# Altium project Athena.PrjPcb
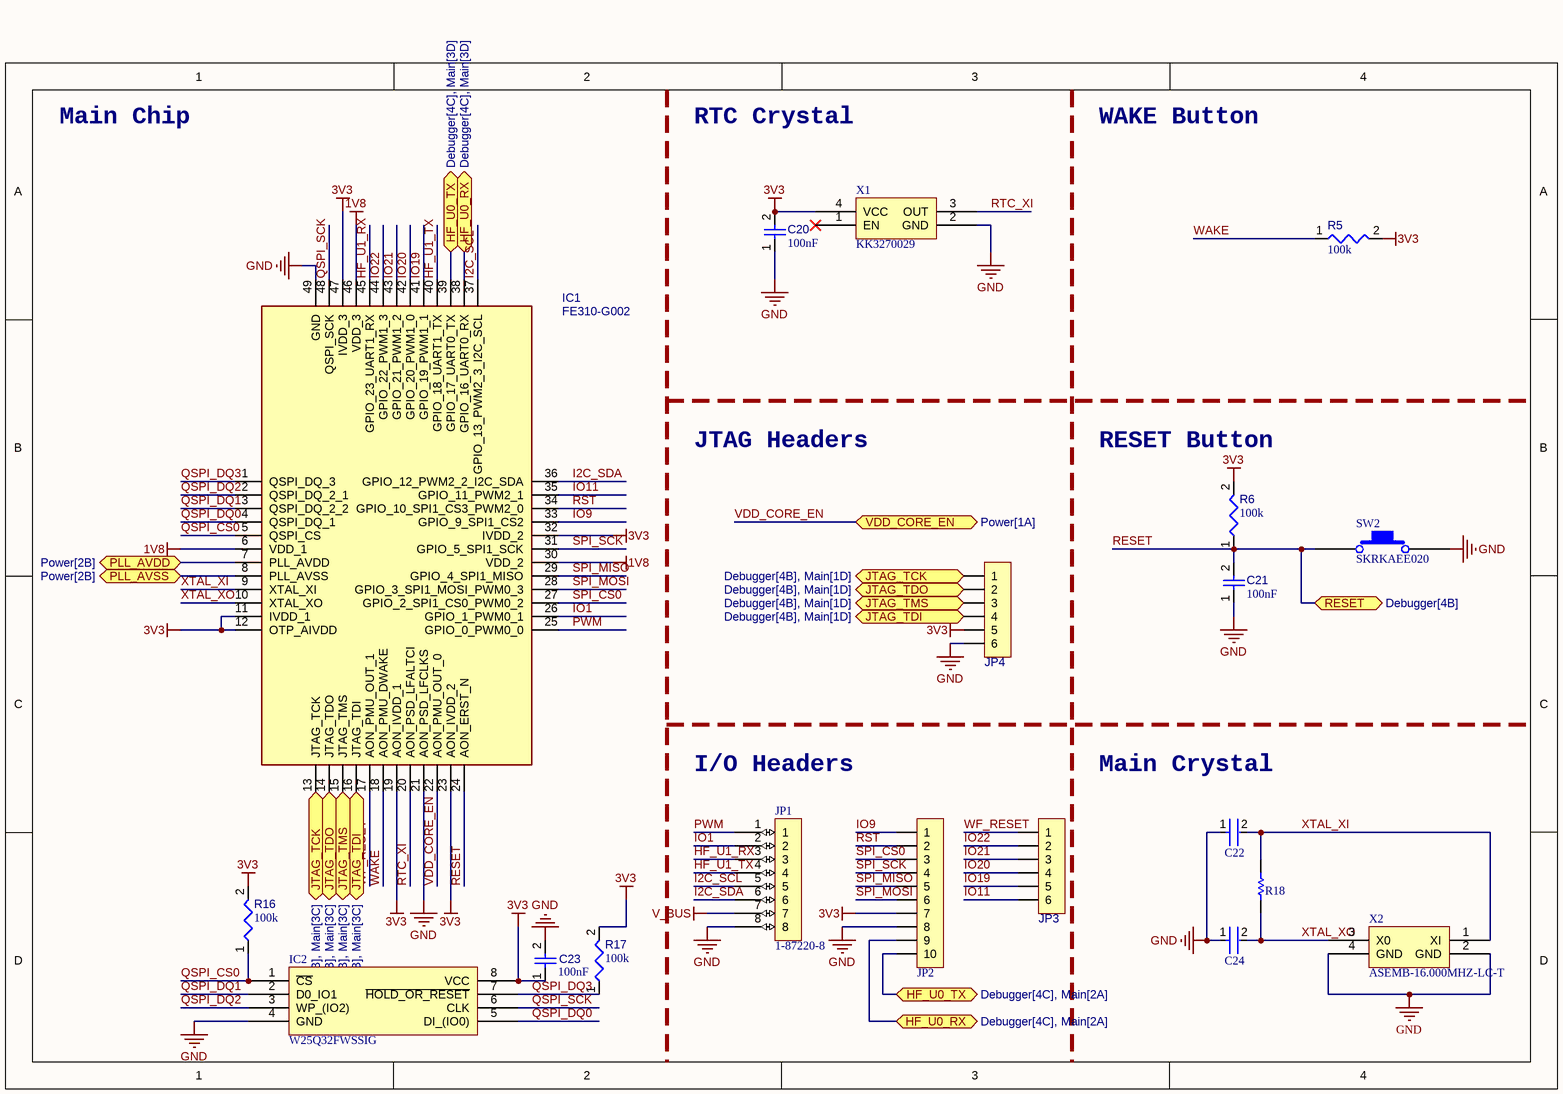
[diagram p0: Main.SchDoc]
3 sheets, 82 parts. Net scope: flat (ports and power ports of the same name join across sheets).
Board file: Board.PcbDoc
Sheets:
  Main.SchDoc
  Power.SchDoc
  Debugger.SchDoc

## Sheet Main.SchDoc
size A4; SheetNumber: 1; SheetTotal: 3

### Parts
C20  value 100nF  [CAPC1608X90X40NL10T20]  (hidden comment: Capacitor 100 nF +/-10% 50 V 0603)
C21  value 100nF  [CAPC1608X90X40NL10T20]  (hidden comment: Capacitor 100 nF +/-10% 50 V 0603)
C22  06035A220JAT2A  [FP-0603-L_1_6_0_15-W_0_81-IPC_C]  (value not drawn)
C23  value 100nF  [CAPC1608X90X40NL10T20]  (hidden comment: Capacitor 100 nF +/-10% 50 V 0603)
C24  06035A220JAT2A  [FP-0603-L_1_6_0_15-W_0_81-IPC_C]  (value not drawn)
IC1  FE310-G002  [QFN40P600X600X93-49N]
IC2  W25Q32FWSSIG  [W25Q32FWSSIG-Footprint-1]
JP1  1-87220-8  [1-87220-8-Footprint-1]
JP2  HDR-1X10  [HDR2.54-LI-10P]  (value not drawn)
JP3  HDR-1X6  [HDR2.54-M-LI-6P]  (value not drawn)
JP4  HDR-1X6  [HDR2.54-M-LI-6P]  (value not drawn)
R5  value 100k  [RESC1608X55X25ML10T15]  (hidden comment: Resistor 100k +/-1% 0603 100 mW)
R6  value 100k  [RESC1608X55X25ML10T15]  (hidden comment: Resistor 100k +/-1% 0603 100 mW)
R16  value 100k  [RESC1608X55X25ML10T15]  (hidden comment: Resistor 100k +/-1% 0603 100 mW)
R17  value 100k  [RESC1608X55X25ML10T15]  (hidden comment: Resistor 100k +/-1% 0603 100 mW)
R18  RC0603FR-071ML  [RESC1608X55X25LL10T15]  (value not drawn)
SW2  SKRKAEE020  [RESC5020X04N]
X1  KK3270029  [KK3270029-Footprint-1]
X2  ASEMB-16.000MHZ-LC-T  [ASEMB-16.000MHZ-LC-T-Footprint-1]

### Ports
HF_U0_RX (bidir, see Debugger[4C], Main[2A]), HF_U0_RX (bidir, see Debugger[4C], Main[3D]), HF_U0_TX (bidir, see Debugger[4C], Main[2A]), HF_U0_TX (bidir, see Debugger[4C], Main[3D]), JTAG_TCK (bidir, see Debugger[4B], Main[1D]), JTAG_TCK (bidir, see Debugger[4B], Main[3C]), JTAG_TDI (bidir, see Debugger[4B], Main[1D]), JTAG_TDI (bidir, see Debugger[4B], Main[3C]), JTAG_TDO (bidir, see Debugger[4B], Main[1D]), JTAG_TDO (bidir, see Debugger[4B], Main[3C]), JTAG_TMS (bidir, see Debugger[4B], Main[1D]), JTAG_TMS (bidir, see Debugger[4B], Main[3C]), PLL_AVDD (bidir, see Power[2B]), PLL_AVSS (bidir, see Power[2B]), RESET (bidir, see Debugger[4B]), VDD_CORE_EN (bidir, see Power[1A])

### Nets
1V8: IC1.6(VDD_1) IC1.30(VDD_2) IC1.46(VDD_3)
3V3: C20.2 C23.1 IC1.11(IVDD_1) IC1.12(OTP_AIVDD) IC1.19(AON_IVDD_1) IC1.23(AON_IVDD_2) IC1.32(IVDD_2) IC1.47(IVDD_3) IC2.8(VCC) JP2.7 JP4.5 R5.2 R6.2 R16.2 R17.2 X1.4(VCC)
GND: C20.1 C21.1 C22.1 C23.2 C24.1 IC1.21(AON_PSD_LFCLKS) IC1.49(GND) IC2.4(GND) JP1.8 JP2.8 JP4.6 SW2.2 X1.2(GND) X2.2(GND) X2.4(GND)
V_BUS: JP1.7
HF_U1_RX: IC1.45(GPIO_23_UART1_RX) JP1.3
HF_U1_TX: IC1.40(GPIO_18_UART1_TX) JP1.4
I2C_SCL: IC1.37(GPIO_13_PWM2_3_I2C_SCL) JP1.5
I2C_SDA: IC1.36(GPIO_12_PWM2_2_I2C_SDA) JP1.6
IO1: IC1.26(GPIO_1_PWM0_1) JP1.2
IO9: IC1.33(GPIO_9_SPI1_CS2) JP2.1
IO11: IC1.35(GPIO_11_PWM2_1) JP3.6
IO19: IC1.41(GPIO_19_PWM1_1) JP3.5
IO20: IC1.42(GPIO_20_PWM1_0) JP3.4
IO21: IC1.43(GPIO_21_PWM1_2) JP3.3
IO22: IC1.44(GPIO_22_PWM1_3) JP3.2
JTAG_TCK: IC1.13(JTAG_TCK) JP4.1 ; port JTAG_TCK
JTAG_TDI: IC1.16(JTAG_TDI) JP4.4 ; port JTAG_TDI
JTAG_TDO: IC1.14(JTAG_TDO) JP4.2 ; port JTAG_TDO
JTAG_TMS: IC1.15(JTAG_TMS) JP4.3 ; port JTAG_TMS
PLL_AVDD: IC1.7(PLL_AVDD) ; port PLL_AVDD
PLL_AVSS: IC1.8(PLL_AVSS) ; port PLL_AVSS
PWM: IC1.25(GPIO_0_PWM0_0) JP1.1
QSPI_CS0: IC1.5(QSPI_CS) IC2.1(~{CS}) R16.1
QSPI_DQ0: IC1.4(QSPI_DQ_1) IC2.5(DI_(IO0))
QSPI_DQ1: IC1.3(QSPI_DQ_2_2) IC2.2(D0_IO1)
QSPI_DQ2: IC1.2(QSPI_DQ_2_1) IC2.3(WP_(IO2))
QSPI_DQ3: IC1.1(QSPI_DQ_3) IC2.7(~{HOLD_OR_RESET}) R17.1
QSPI_SCK: IC1.48(QSPI_SCK) IC2.6(CLK)
RESET: C21.2 IC1.24(AON_ERST_N) R6.1 SW2.1 ; port RESET
RST: IC1.34(GPIO_10_SPI1_CS3_PWM2_0) JP2.2
RTC_XI: IC1.20(AON_PSD_LFALTCI) X1.3(OUT)
SPI_CS0: IC1.27(GPIO_2_SPI1_CS0_PWM0_2) JP2.3
SPI_MISO: IC1.29(GPIO_4_SPI1_MISO) JP2.5
SPI_MOSI: IC1.28(GPIO_3_SPI1_MOSI_PWM0_3) JP2.6
SPI_SCK: IC1.31(GPIO_5_SPI1_SCK) JP2.4
UART0_RX: IC1.38(GPIO_16_UART0_RX) JP2.9 ; port HF_U0_RX
UART0_TX: IC1.39(GPIO_17_UART0_TX) JP2.10 ; port HF_U0_TX
VDD_CORE_EN: IC1.22(AON_PMU_OUT_0) ; port VDD_CORE_EN
WAKE: IC1.18(AON_PMU_DWAKE) R5.1
WF_RESET: IC1.17(AON_PMU_OUT_1) JP3.1
XTAL_XI: C22.2 IC1.9(XTAL_XI) R18.2 X2.1(XI)
XTAL_XO: C24.2 IC1.10(XTAL_XO) R18.1 X2.3(X0)

Not connected (* = marked no-connect by the designer): X1 1(EN)*

### Notes on the sheet
- Main Chip
- RTC Crystal
- WAKE Button
- JTAG Headers
- (near R6) RESET Button
- I/O Headers
- Main Crystal

### Library data of the parts
C20 C21 C23 = CMP-001-00017-6: Chip Capacitor, 100 nF, +/- 10%, 50 V, 0603 (1608 Metric); Voltage Rating: 50V; Capacitor Type: Ceramic; Tolerance: 10%; Mounting Technology: SM; Max Operating Temperature: 125°C; RoHS Compliant: True; Pins: 2; Case/Package: 0603; Min Operating Temperature: -55°C
C22 C24 = CMP-001-00085-1: 0603 22 pF 50V ±5% Tolerance C0G/NP0 Surface Mount Multilayer Ceramic Capacitor
IC1 = FE310-G002: Integrated Circuit; Manufacturer_Name: SiFive; Datasheet Link: https://sifive.cdn.prismic.io/sifive%2F3d777659-a0dd-49ed-a011-5bebba17aecf_fe310-g002-ds.pdf; Height: 0.93mm; Manufacturer_Part_Number: FE310-G002
IC2 = CMP-001-0001-2: IC Flash 32M Spi 104MHZ 8SOIC / 1.8V 32M-BIT Serial Flash Memory With Dual/quad Spi & Qpi
JP1 = CMP-002-00072-1: Conn Unshrouded Header HDR 1x8 POS 2.54mm Solder ST Thru-Hole Carton
JP2 = Header 10: 10P接插件; 版权归属: 淘宝ID:黄晶宝石; BOM名称: 10P接插件; 学习资源: https://shop463601444.taobao.com
JP3 JP4 = Header 6: 6P接插件; 联系卖家，免费查找封装: 唯一出售店铺网址https://shop463601444.taobao.com; 封装库来自淘宝卖家ID:黄晶宝石: 其他店铺购入均为盗版假冒封装库，请立即申请退款，本店现金奖励20~200元; BOM名称: 6P接插件
R5 R6 R16 R17 = CMP-009-00023-5: Chip Resistor, 100 KOhm, +/- 1%, 0.1 W, -55 to 155 degC, 0603 (1608 Metric); Voltage Rating: 50V; Power: 100mW; Max Operating Temperature: 155°C; RoHS Compliant: True; Tolerance: 1%; Pins: 2; Case/Package: 0603; Mounting Technology: SM; Min Operating Temperature: -55°C
R18 = CMP-009-00177-1: Res Thick Film 0603 1M Ohm 1% 1/10W ±100ppm/°C Molded SMD Paper T/R
SW2 = CMP-011-00014-1: Switch Tactile N.O. SPST Round Button Gull Wing 0.05A 12VDC 1.57N SMD T/R
X1 = CMP-023-00000-1: Xtal Osc Xo 32.7680KHZ Cmos SMD
X2 = CMP-023-00001-1: Oscillator MEMS 16MHz ±50ppm (Stability) 15pF LVCMOS 55% 1.8V/2.5V/3.3V Automotive 4-Pin QFN SMD T/R

## Sheet Power.SchDoc
size A4; SheetNumber: 2; SheetTotal: 3
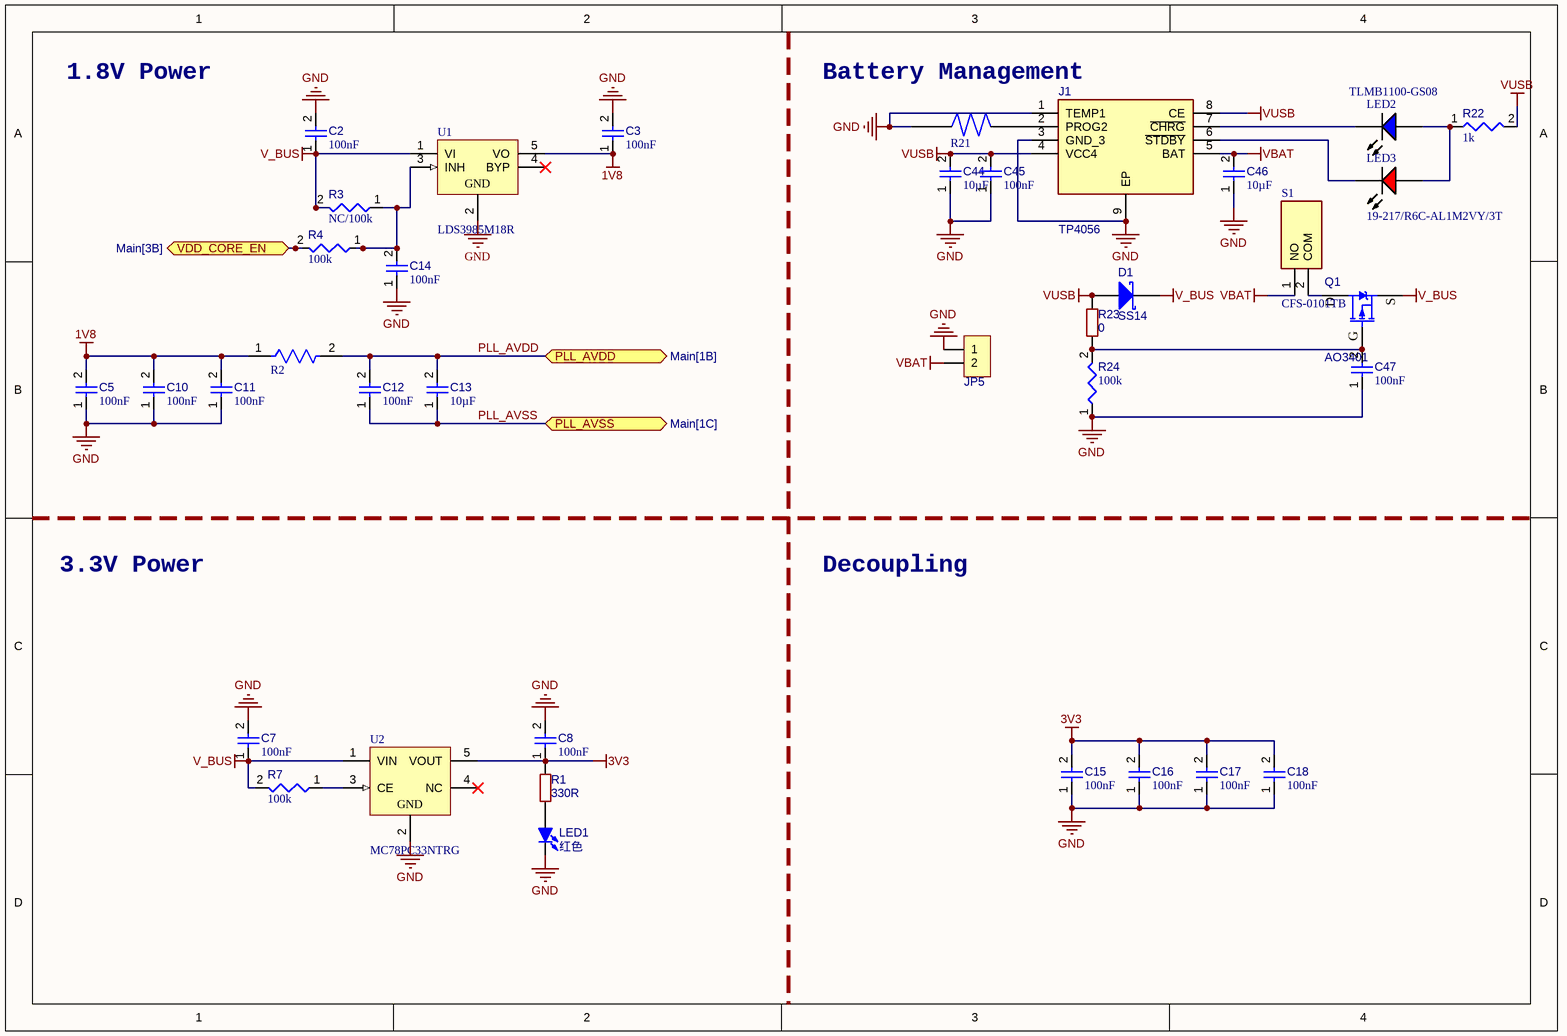
[diagram p1: Power.SchDoc]

### Parts
C2  value 100nF  [CAPC1608X90X40NL10T20]  (hidden comment: Capacitor 100 nF +/-10% 50 V 0603)
C3  value 100nF  [CAPC1608X90X40NL10T20]  (hidden comment: Capacitor 100 nF +/-10% 50 V 0603)
C5  value 100nF  [CAPC1608X90X40NL10T20]  (hidden comment: Capacitor 100 nF +/-10% 50 V 0603)
C7  value 100nF  [CAPC1608X90X40NL10T20]  (hidden comment: Capacitor 100 nF +/-10% 50 V 0603)
C8  value 100nF  [CAPC1608X90X40NL10T20]  (hidden comment: Capacitor 100 nF +/-10% 50 V 0603)
C10  value 100nF  [CAPC1608X90X40NL10T20]  (hidden comment: Capacitor 100 nF +/-10% 50 V 0603)
C11  value 100nF  [CAPC1608X90X40NL10T20]  (hidden comment: Capacitor 100 nF +/-10% 50 V 0603)
C12  value 100nF  [CAPC1608X90X40NL10T20]  (hidden comment: Capacitor 100 nF +/-10% 50 V 0603)
C13  value 10µF  [CAPC0603(1608)100_L]  (hidden comment: Capacitor 10µF +/-20% 10V 0603)
C14  value 100nF  [CAPC1608X90X40NL10T20]  (hidden comment: Capacitor 100 nF +/-10% 50 V 0603)
C15  value 100nF  [CAPC1608X90X40NL10T20]  (hidden comment: Capacitor 100 nF +/-10% 50 V 0603)
C16  value 100nF  [CAPC1608X90X40NL10T20]  (hidden comment: Capacitor 100 nF +/-10% 50 V 0603)
C17  value 100nF  [CAPC1608X90X40NL10T20]  (hidden comment: Capacitor 100 nF +/-10% 50 V 0603)
C18  value 100nF  [CAPC1608X90X40NL10T20]  (hidden comment: Capacitor 100 nF +/-10% 50 V 0603)
C44  value 10µF  [CAPC0603(1608)100_L]  (hidden comment: Capacitor 10µF +/-20% 10V 0603)
C45  value 100nF  [CAPC1608X90X40NL10T20]  (hidden comment: Capacitor 100 nF +/-10% 50 V 0603)
C46  value 10µF  [CAPC0603(1608)100_L]  (hidden comment: Capacitor 10µF +/-20% 10V 0603)
C47  value 100nF  [CAPC1608X90X40NL10T20]  (hidden comment: Capacitor 100 nF +/-10% 50 V 0603)
D1  SS14  [SMA]
J1  TP4056  [SOIC127P600X175-9N]
JP5  HDR-1X2  [XH2.54-LS-2P]  (value not drawn)
LED1  红色  [LED0603_R]
LED2  TLMB1100-GS08  [VISH-TLMX1100-2_V]
LED3  19-217/R6C-AL1M2VY/3T  [EVRL-0603-2_V]
Q1  AO3401  [SOT23-3N]
R1  330R  [R0603_NS]
R2  CRGP0603F100R  [FP-CRGP0603-IPC_B]  (value not drawn)
R3  value NC/100k  [RESC1608X55X25ML10T15]  (hidden comment: Resistor 100k +/-1% 0603 100 mW)
R4  value 100k  [RESC1608X55X25ML10T15]  (hidden comment: Resistor 100k +/-1% 0603 100 mW)
R7  value 100k  [RESC1608X55X25ML10T15]  (hidden comment: Resistor 100k +/-1% 0603 100 mW)
R21  CRCW06031K20FKTA  [CRCW06031K20FKTA-Footprint-1]  (value not drawn)
R22  value 1k  [RESC1608X55X25ML10T15]  (hidden comment: Resistor 1k +/-1% 0603 100 mW)
R23  0  [R0603_NS]
R24  value 100k  [RESC1608X55X25ML10T15]  (hidden comment: Resistor 100k +/-1% 0603 100 mW)
S1  CFS-0101TB  [CFS0101TB]
U1  LDS3985M18R  [SOT23-5L_N]
U2  MC78PC33NTRG  [ONSC-SOT-23-5-1212-01_O_V]

### Ports
PLL_AVDD (bidir, see Main[1B]), PLL_AVSS (bidir, see Main[1C]), VDD_CORE_EN (bidir, see Main[3B])

### Nets
1V8: C3.1 C5.2 C10.2 C11.2 R2.1 U1.5(VO)
3V3: C8.1 C15.2 C16.2 C17.2 C18.2 R1.1 U2.5(VOUT)
GND: C2.2 C3.2 C5.1 C7.2 C8.2 C10.1 C11.1 C14.1 C15.1 C16.1 C17.1 C18.1 C44.1 C45.1 C46.1 C47.1 J1.1(TEMP1) J1.3(GND_3) J1.9(EP) JP5.1 LED1.2(K) R21.1 R24.1 U1.2(GND) U2.2(GND)
V_BUS: C2.1 C7.1 D1.2(K) Q1.2(S) R3.2 R7.2 U1.1(VI) U2.1(VIN)
VBAT: C46.2 J1.5(BAT) JP5.2 S1.1(NO)
VUSB: C44.2 C45.2 D1.1(A) J1.4(VCC4) J1.8(CE) R22.2 R23.2
PLL_AVDD: C12.2 C13.2 R2.2 ; port PLL_AVDD
PLL_AVSS: C12.1 C13.1 ; port PLL_AVSS
VDD_CORE_EN: R4.2 ; port VDD_CORE_EN
NetC14_2: C14.2 R3.1 R4.1 U1.3(INH)
NetC47_2: C47.2 Q1.1(G) R23.1 R24.2
NetJ1_2: J1.2(PROG2) R21.2
NetJ1_6: J1.6(~{STDBY}) LED3.2(K)
NetJ1_7: J1.7(~{CHRG}) LED2.2(K)
NetLED1_1: LED1.1(A) R1.2
NetLED2_1: LED2.1(A) LED3.1(A) R22.1
NetQ1_3: Q1.3(D) S1.2(COM)
NetR7_1: R7.1 U2.3(CE)

Not connected (* = marked no-connect by the designer): U1 4(BYP)*; U2 4(NC)*

### Notes on the sheet
- 1.8V Power
- Battery Management
- 3.3V Power
- Decoupling

### Library data of the parts
C2 C3 C5 C7 C8 C10-C12 C14-C18 C45 C47 = CMP-001-00017-6: as C20 on sheet Main; Tolerance: 10%; Mounting Technology: SM; Max Operating Temperature: 125°C; RoHS Compliant: True; Pins: 2; Case/Package: 0603; Min Operating Temperature: -55°C
C13 C44 C46 = CMP-001-00075-4: Chip Capacitor, 10µF +/-20%, 10V, 0603, Thickness 1 mm; Tolerance: 10%; Voltage Rating: 10V; Max Operating Temperature: 85°C; Pins: 2; Case/Package: 0603; Mounting Technology: SMT; Min Operating Temperature: -55°C
D1 = SS14: 肖特基二极管; 属性: 40V/1A; 以赠品形式获赠本封装库的买家，还可联系卖家免费指导AD软件使用: 封装库来自淘宝卖家ID：黄晶宝石; BOM名称: 肖特基二极管
J1 = TP4056: Connector; Manufacturer_Name: NanJing Top Power; Datasheet Link: https://dlnmh9ip6v2uc.cloudfront.net/datasheets/Prototyping/TP4056.pdf; Height: 1.75mm; Manufacturer_Part_Number: TP4056
JP5 = Header 2: 2P接插件; 联系卖家，免费查找封装: 唯一出售店铺网址https://shop463601444.taobao.com; 封装库来自淘宝卖家ID:黄晶宝石: 其他店铺购入均为盗版假冒封装库，请立即申请退款，本店现金奖励20~200元; BOM名称: 2P接插件
LED1 = LED-SMD: 贴片LED; 封装库来自淘宝卖家ID：黄晶宝石: 其他店铺购入均为盗版封装库，请立即申请退款，本店现金奖励20~200元; BOM名称: 贴片LED
LED2 = CMP-007-00028-2: Blue LED, 10 mA, 3.9 V, -40 to 100 degC, 2-Pin SMD (0603), RoHS, Tape and Reel; Manufacturer: Vishay Semiconductor; Forward Voltage: 3.9V; Viewing Angle: 160degrees; Power: 68mW; Forward Current: 10mA; Lens Style: Diffused; Luminous Intensity: 5mcd; Case/Package: 0603; Datasheet URL: http://download.siliconexpert.com/pdfs/2016/8/7/12/43/26/667/vsh_/manual/379263299541529tlmb1100.pdf; Illumination Colour: Blue; Datasheet Version: Rev. 2.7, 03/2016; Manufacturer URL: http://www.vishay.com/; Package Reference: 0603; Min Operating Temperature: -40°C; Packaging: TapeandReel; RoHS Compliant: True; Nominal Vf: 3.9V; Mounting Technology: SM; Pins: 2; Package Description: 2-Pin Surface Mount Device, Body 1.6 x 0.8 mm; Colour: Blue; Package Quantity: 3000; Max Operating Temperature: 100°C
LED3 = CMP-007-00004-2: Chip LED, Red, 5 V, 25 mA, -40 to 85 degC, 2-Pin SMD (0603), RoHS, Tape and Reel; Manufacturer: Everlight Electronics; Forward Voltage: 2.2V; Lens Style: Clear; Package Reference: 0603; Datasheet Version: Rev. 1, 01/2005; Mounting Technology: SM; RoHS Compliant: False; Datasheet URL: https://datasheet.ciiva.com/4688/el-19-217-r6c-al1m2vy-3tpdf-187026-4688713.pdf; Case/Package: 0603; Colour: Red; Manufacturer URL: http://www.everlight.com/; Package Description: 2-Pin Surface Mount Device, Body 1.6 x 0.8 mm
Q1 = AO3401: P沟道 30V/4.2A; BOM名称: 场效应管; 8元以下特价购入的买家: 还可以联系卖家远程指导AD软件使用; 参数: P沟道 30V/4.2A
R1 R23 = R: 贴片电阻; 联系卖家，免费查找封装: 唯一出售店铺网址https://shop463601444.taobao.com; BOM名称: 贴片电阻
R2 = CMP-009-00180-1: Res Thick Film 0603 100 Ohm 1% 0.25W(1/4W) ±100ppm/C Pad SMD T/R
R3 R4 R7 R24 = CMP-009-00023-5: as R5 on sheet Main; Max Operating Temperature: 155°C; RoHS Compliant: True; Tolerance: 1%; Pins: 2; Case/Package: 0603; Mounting Technology: SM; Min Operating Temperature: -55°C
R21 = CMP-009-00181-1: Res Thick Film 0603 1.2K Ohm 1% 1/10W ±100ppm/°C Molded SMD SMD Paper T/R
R22 = CMP-009-00014-5: Chip Resistor, 1 KOhm, +/-1%, 0.1 W, -55 to 155 degC, 0603 (1608 Metric); Voltage Rating: 50V; Power: 100mW; Tolerance: 1%; Mounting Technology: SM; Pins: 2; Case/Package: 0603; Min Operating Temperature: -55°C; RoHS Compliant: True; Max Operating Temperature: 155°C
S1 = CFS-0101TB: Switch; Manufacturer_Name: NIDEC COPAL; Datasheet Link: https://au.mouser.com/datasheet/2/972/cfs-1628139.pdf; Height: 4mm; Manufacturer_Part_Number: CFS-0101TB; Mouser Part Number: 229-CFS-0101TB; Mouser Price/Stock: https://www.mouser.co.uk/ProductDetail/Nidec-Copal/CFS-0101TB?qs=XeJtXLiO41RUoaDpyshzOQ%3D%3D
U1 = CMP-019-00049-1: LDS3985 Series 1.8 V 300 mA Fixed Surface Mount Voltage Regulator - SOT-23-5; Max Supply Current: 300uA; Output Voltage: 1.8V; Number of Regulators: 1; Output Configuration: Positive; Max Supply Voltage: 6V; Power Supply Rejection Ratio (PSRR): 50dB; Input Bias Current: 85uA; Output Current: 300mA; Min Input Voltage: 2.5V; Quiescent Current: 150uA; Min Operating Temperature: -40°C; Radiation Hardening: No; Case/Package: SOT-23; Series: -; Packaging: Tape and Reel; Min Output Voltage: 1.8V; Lead Free: Lead Free; Number of Outputs: 1; Output Type: Fixed; RoHS Compliant: Yes; Polarity: Positive; Max Output current: 300mA; Max Operating Temperature: 125°C; Pins: 5; Mounting Technology: Surface Mount; Package Quantity: 3000
U2 = CMP-019-00028-3: Low Noise Low Drop Out (LDO) Linear Voltage Regulator, 3.3 V Output Voltage, 150 mA, -40 to 85 degC, 5-Pin SOT-23 (1212-01), Pb-Free, Tape and Reel; Manufacturer: ON Semiconductor; Outputs: 1; Power Rating: 250mW; Nominal Output Voltage: 3.3V; Min Input Voltage: 4.3V; Dropout Voltage: 300mV; Max Ouput Current: 150mA; Max Input Voltage: 8V; Package Quantity: 3000; Mounting Technology: SM; Case/Package: SOT-23-5; RoHS Compliant: True; Datasheet Version: Rev. 6, 06/2005; Packaging: TapeandReel; Max Operating Temperature: 85°C; Power: 250mW; Output Voltage: 3.3V; Package Reference: SOT-23-5-1212-01_O; Manufacturer URL: http://www.onsemi.com/; Package Description: 5-Pin Small Outline Transistor, Body 2.9 x 1.65 mm, Pitch 0.95 mm; Output Current: 150mA; Datasheet URL: http://www.onsemi.com/pub_link/Collateral/MC78PC00-D.PDF; Min Operating Temperature: -40°C; Pins: 5

## Sheet Debugger.SchDoc
size A4; SheetNumber: 3; SheetTotal: 3
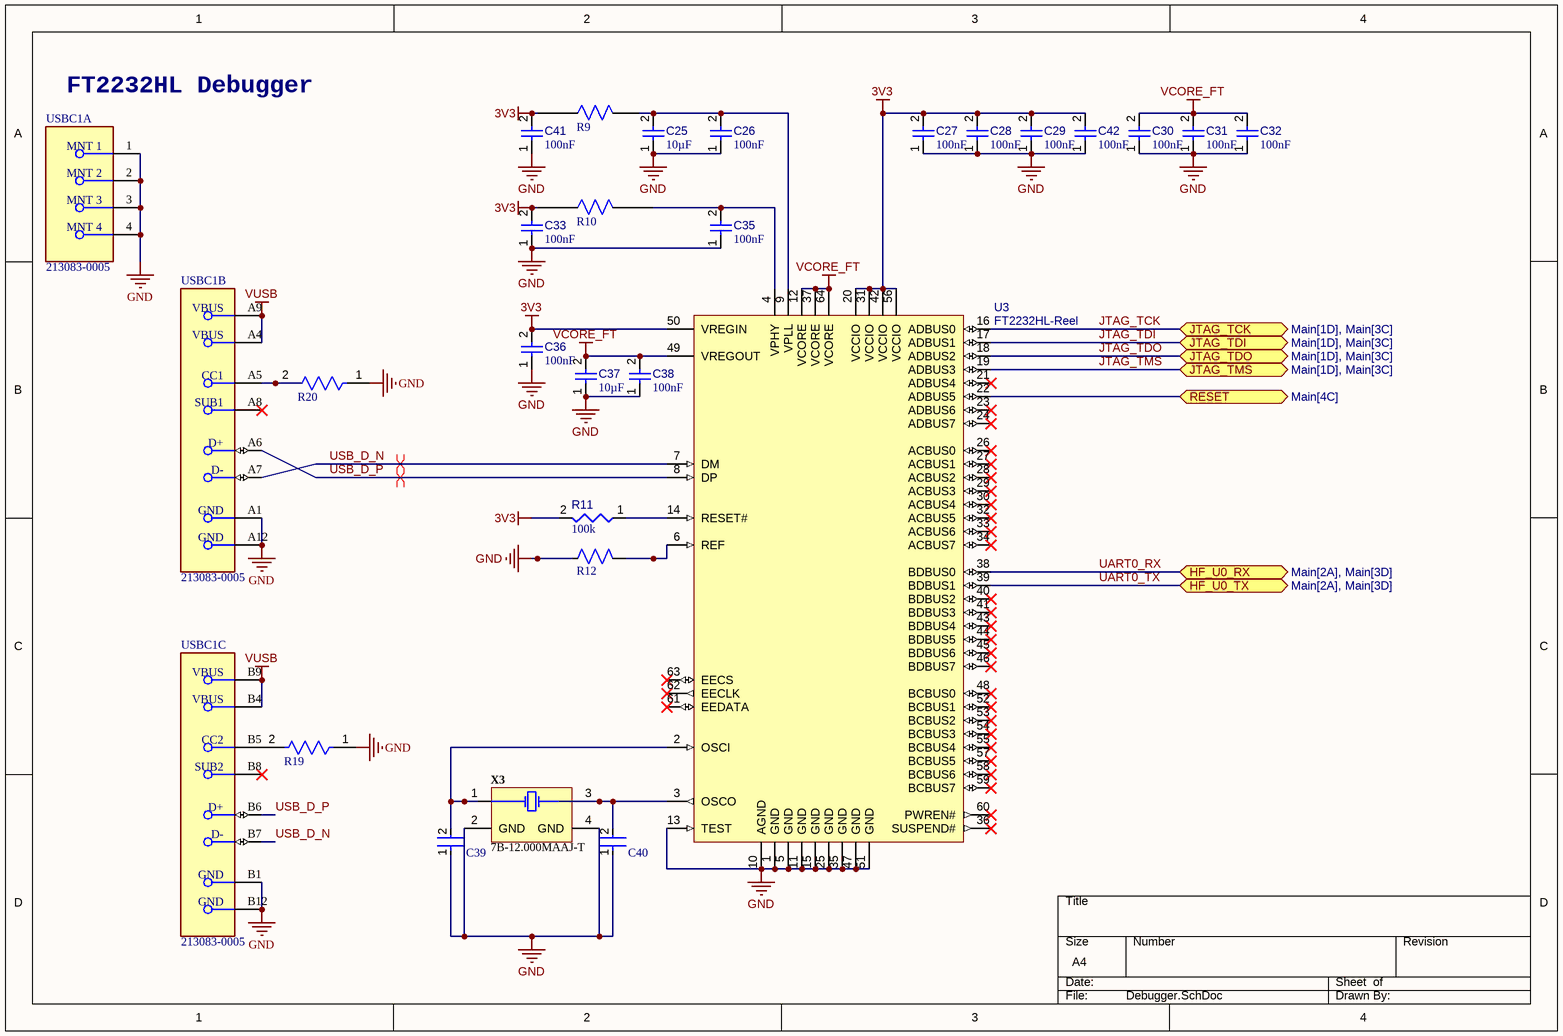
[diagram p2: Debugger.SchDoc]

### Parts
C25  value 10µF  [CAPC0603(1608)100_L]  (hidden comment: Capacitor 10µF +/-20% 10V 0603)
C26  value 100nF  [CAPC1608X90X40NL10T20]  (hidden comment: Capacitor 100 nF +/-10% 50 V 0603)
C27  value 100nF  [CAPC1608X90X40NL10T20]  (hidden comment: Capacitor 100 nF +/-10% 50 V 0603)
C28  value 100nF  [CAPC1608X90X40NL10T20]  (hidden comment: Capacitor 100 nF +/-10% 50 V 0603)
C29  value 100nF  [CAPC1608X90X40NL10T20]  (hidden comment: Capacitor 100 nF +/-10% 50 V 0603)
C30  value 100nF  [CAPC1608X90X40NL10T20]  (hidden comment: Capacitor 100 nF +/-10% 50 V 0603)
C31  value 100nF  [CAPC1608X90X40NL10T20]  (hidden comment: Capacitor 100 nF +/-10% 50 V 0603)
C32  value 100nF  [CAPC1608X90X40NL10T20]  (hidden comment: Capacitor 100 nF +/-10% 50 V 0603)
C33  value 100nF  [CAPC1608X90X40NL10T20]  (hidden comment: Capacitor 100 nF +/-10% 50 V 0603)
C35  value 100nF  [CAPC1608X90X40NL10T20]  (hidden comment: Capacitor 100 nF +/-10% 50 V 0603)
C36  value 100nF  [CAPC1608X90X40NL10T20]  (hidden comment: Capacitor 100 nF +/-10% 50 V 0603)
C37  value 10µF  [CAPC0603(1608)100_L]  (hidden comment: Capacitor 10µF +/-20% 10V 0603)
C38  value 100nF  [CAPC1608X90X40NL10T20]  (hidden comment: Capacitor 100 nF +/-10% 50 V 0603)
C39  06035A220JAT2A  [FP-0603-L_1_6_0_15-W_0_81-IPC_C]  (value not drawn)
C40  06035A220JAT2A  [FP-0603-L_1_6_0_15-W_0_81-IPC_C]  (value not drawn)
C41  value 100nF  [CAPC1608X90X40NL10T20]  (hidden comment: Capacitor 100 nF +/-10% 50 V 0603)
C42  value 100nF  [CAPC1608X90X40NL10T20]  (hidden comment: Capacitor 100 nF +/-10% 50 V 0603)
R9  PFC-W0603R-02-5R00-F  [PFC-W0603R-02-5R00-F-Footprint-1]  (value not drawn)
R10  PFC-W0603R-02-5R00-F  [PFC-W0603R-02-5R00-F-Footprint-1]  (value not drawn)
R11  value 100k  [RESC1608X55X25ML10T15]  (hidden comment: Resistor 100k +/-1% 0603 100 mW)
R12  CRG0603F12K  [CRG0603F12K-Footprint-1]  (value not drawn)
R19  CRCW06035K10JNEA  [FP-CRCW0603-e3-IPC_C]  (value not drawn)
R20  CRCW06035K10JNEA  [FP-CRCW0603-e3-IPC_C]  (value not drawn)
U3  FT2232HL-Reel  [LQFP-64_M]
USBC1  213083-0005  [FP-213083-0005-MFG]  (parts A,B,C of 3)
X3  7B-12.000MAAJ-T  [TXC-7B-4_V]

### Ports
HF_U0_RX (bidir, see Main[2A], Main[3D]), HF_U0_TX (bidir, see Main[2A], Main[3D]), JTAG_TCK (bidir, see Main[1D], Main[3C]), JTAG_TDI (bidir, see Main[1D], Main[3C]), JTAG_TDO (bidir, see Main[1D], Main[3C]), JTAG_TMS (bidir, see Main[1D], Main[3C]), RESET (bidir, see Main[4C])

### Nets
3V3: C27.2 C28.2 C29.2 C33.2 C36.2 C41.2 C42.2 R9.1 R10.1 R11.2 U3.20(VCCIO) U3.31(VCCIO) U3.42(VCCIO) U3.50(VREGIN) U3.56(VCCIO)
GND: C25.1 C26.1 C27.1 C28.1 C29.1 C30.1 C31.1 C32.1 C33.1 C35.1 C36.1 C37.1 C38.1 C39.1 C40.1 C41.1 C42.1 R12.1 R19.1 R20.1 U3.1(GND) U3.5(GND) U3.10(AGND) U3.11(GND) U3.13(TEST) U3.15(GND) U3.25(GND) U3.35(GND) U3.47(GND) U3.51(GND) USBC1.1(MNT_1) USBC1.2(MNT_2) USBC1.3(MNT_3) USBC1.4(MNT_4) USBC1.A1(GND) USBC1.A12(GND) USBC1.B1(GND) USBC1.B12(GND) X3.2(GND) X3.4(GND)
VCORE_FT: C30.2 C31.2 C32.2 C37.2 C38.2 U3.12(VCORE) U3.37(VCORE) U3.49(VREGOUT) U3.64(VCORE)
VUSB: USBC1.A4(VBUS) USBC1.A9(VBUS) USBC1.B4(VBUS) USBC1.B9(VBUS)
JTAG_TCK: U3.16(ADBUS0) ; port JTAG_TCK
JTAG_TDI: U3.17(ADBUS1) ; port JTAG_TDI
JTAG_TDO: U3.18(ADBUS2) ; port JTAG_TDO
JTAG_TMS: U3.19(ADBUS3) ; port JTAG_TMS
RESET: U3.22(ADBUS5) ; port RESET
UART0_RX: U3.38(BDBUS0) ; port HF_U0_RX
UART0_TX: U3.39(BDBUS1) ; port HF_U0_TX
USB_D_N: U3.7(DM) USBC1.A7(D-) USBC1.B7(D-)
USB_D_P: U3.8(DP) USBC1.A6(D+) USBC1.B6(D+)
NetC25_2: C25.2 C26.2 R9.2 U3.9(VPLL)
NetC35_2: C35.2 R10.2 U3.4(VPHY)
NetC39_2: C39.2 U3.2(OSCI) X3.1(X1)
NetC40_2: C40.2 U3.3(OSCO) X3.3(X2)
NetR11_1: R11.1 U3.14(RESET#)
NetR12_2: R12.2 U3.6(REF)
NetR19_2: R19.2 USBC1.B5(CC2)
NetR20_2: R20.2 USBC1.A5(CC1)

Not connected (* = marked no-connect by the designer): U3 21(ADBUS4)* 23(ADBUS6)* 24(ADBUS7)* 26(ACBUS0)* 27(ACBUS1)* 28(ACBUS2)* 29(ACBUS3)* 30(ACBUS4)* 32(ACBUS5)* 33(ACBUS6)* 34(ACBUS7)* 36(SUSPEND#)* 40(BDBUS2)* 41(BDBUS3)* 43(BDBUS4)* 44(BDBUS5)* 45(BDBUS6)* 46(BDBUS7)* 48(BCBUS0)* 52(BCBUS1)* 53(BCBUS2)* 54(BCBUS3)* 55(BCBUS4)* 57(BCBUS5)* 58(BCBUS6)* 59(BCBUS7)* 60(PWREN#)* 61(EEDATA)* 62(EECLK)* 63(EECS)*; USBC1 A8(SUB1)* B8(SUB2)*

### Layout directives
differential pair: USB_D_N, USB_D_P

### Notes on the sheet
- FT2232HL Debugger

### Library data of the parts
C25 C37 = CMP-001-00075-4: as C13 on sheet Power; Voltage Rating: 10V; Max Operating Temperature: 85°C; Pins: 2; Case/Package: 0603; Mounting Technology: SMT; Min Operating Temperature: -55°C
C26-C33 C35 C36 C38 C41 C42 = CMP-001-00017-6: as C20 on sheet Main; Tolerance: 10%; Mounting Technology: SM; Max Operating Temperature: 125°C; RoHS Compliant: True; Pins: 2; Case/Package: 0603; Min Operating Temperature: -55°C
C39 C40 = CMP-001-00085-1: as C22 on sheet Main
R9 R10 = CMP-009-00178-1: 5 Ohm 1% 50PPM 1/10W
R11 = CMP-009-00023-5: as R5 on sheet Main; Max Operating Temperature: 155°C; RoHS Compliant: True; Tolerance: 1%; Pins: 2; Case/Package: 0603; Mounting Technology: SM; Min Operating Temperature: -55°C
R12 = CMP-001-00089-1: Res Thick Film 0603 12K Ohm 1% 0.1W(1/10W) ±100ppm/C Pad SMD T/R
R19 R20 = CMP-009-00179-1: Res Thick Film 0603 5.1K Ohm 5% 1/10W ±200ppm/°C Molded SMD SMD Paper T/R
U3 = CMP-0078-00023-3: Dual High Speed USB To Multipurpose UART/FIFO IC, 64-pin LQFP, Tape and Reel; Manufacturer: FTDI; DatasheetVersion: ver 2.21, Jun-2012; ComponentLink1URL: http://www.ftdichip.com/; PartNumber: FT2232HL-Reel; ComponentLink2Description: Datasheet; RevisionNote: DatasheetVersion updated to 2.21 Jun-2012; PackageVersion: Jun-12; ComponentLink1Description: Manufacturer URL; ComponentLink2URL: http://www.ftdichip.com/Support/Documents/DataSheets/ICs/DS_FT2232H.pdf; PackageReference: LQFP-64; PackageDescription: 64-Pin Thin Quad Flat Pack, 10 x 10 x 1.4 mm Body, 0.5 mm Pitch
USBC1 = CMP-002-00073-2: Connector USB Type C Receptacle 16 Position 0.5mm Surface Mount Right Angle Emboss T/R
X3 = CMP-003-00007-2: SMD Seam Sealing Crystal, 12 MHz, +/- 30 ppm, 18 pF, -10 to 70 degC, 4-Pin SMD, RoHS, Tape and Reel; Manufacturer: TXC; Frequency: 12MHz; Tolerance: 30ppm; Resistance: 100Ohm; ESR: 40; Load Capacitance: 18pF; Package Quantity: 1; Pins: 4; Datasheet URL: http://www.txccorp.com/download/products/quartz_crystals/2015TXC_7B_19.pdf; Case/Package: 7B-4; Max Operating Temperature: 70°C; Packaging: TapeandReel; Package Description: 4-Pin Surface Mount Device, Body 5 x 3.2 mm, Pitch 3.7 mm; Frequency Tolerance: 30ppm; RoHS Compliant: True; Mounting Technology: SM; Package Reference: 7B-4; Min Operating Temperature: -20°C; Datasheet Version: Jul-15

## Nets that join several sheets
1V8: Main (IC1.6 IC1.30 IC1.46), Power (6 pins)
3V3: Main (16 pins), Power (7 pins), Debugger (15 pins)
GND: Main (15 pins), Power (25 pins), Debugger (40 pins)
V_BUS: Main (JP1.7), Power (8 pins)
VUSB: Power (7 pins), Debugger (USBC1.A4 USBC1.A9 USBC1.B4 USBC1.B9)
JTAG_TCK: Main (IC1.13 JP4.1), Debugger (U3.16)
JTAG_TDI: Main (IC1.16 JP4.4), Debugger (U3.17)
JTAG_TDO: Main (IC1.14 JP4.2), Debugger (U3.18)
JTAG_TMS: Main (IC1.15 JP4.3), Debugger (U3.19)
PLL_AVDD: Main (IC1.7), Power (C12.2 C13.2 R2.2)
PLL_AVSS: Main (IC1.8), Power (C12.1 C13.1)
RESET: Main (C21.2 IC1.24 R6.1 SW2.1), Debugger (U3.22)
UART0_RX: Main (IC1.38 JP2.9), Debugger (U3.38)
UART0_TX: Main (IC1.39 JP2.10), Debugger (U3.39)
VDD_CORE_EN: Main (IC1.22), Power (R4.2)